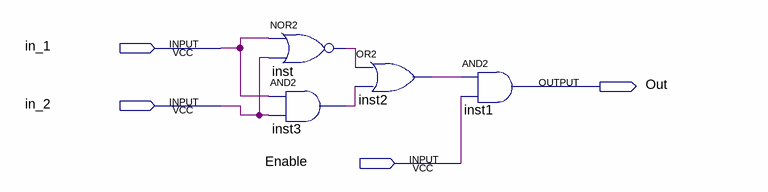
[diagram p0: schematic sheet]
// Quartus schematic comparator.bdf as structural Verilog: 4 symbols, 4 pins
module comparator (
  input  in_1,
  input  in_2,
  input  Enable,
  output Out
);

  wire inst2_out, inst3_out, inst_out;

  nor inst (inst_out, in_1, in_2);
  and inst3 (inst3_out, in_1, in_2);
  or inst2 (inst2_out, inst_out, inst3_out);
  and inst1 (Out, inst2_out, Enable);
endmodule
